# EAGLE schematic GPS_radiologger_v15 (EAGLE 9.6.2)
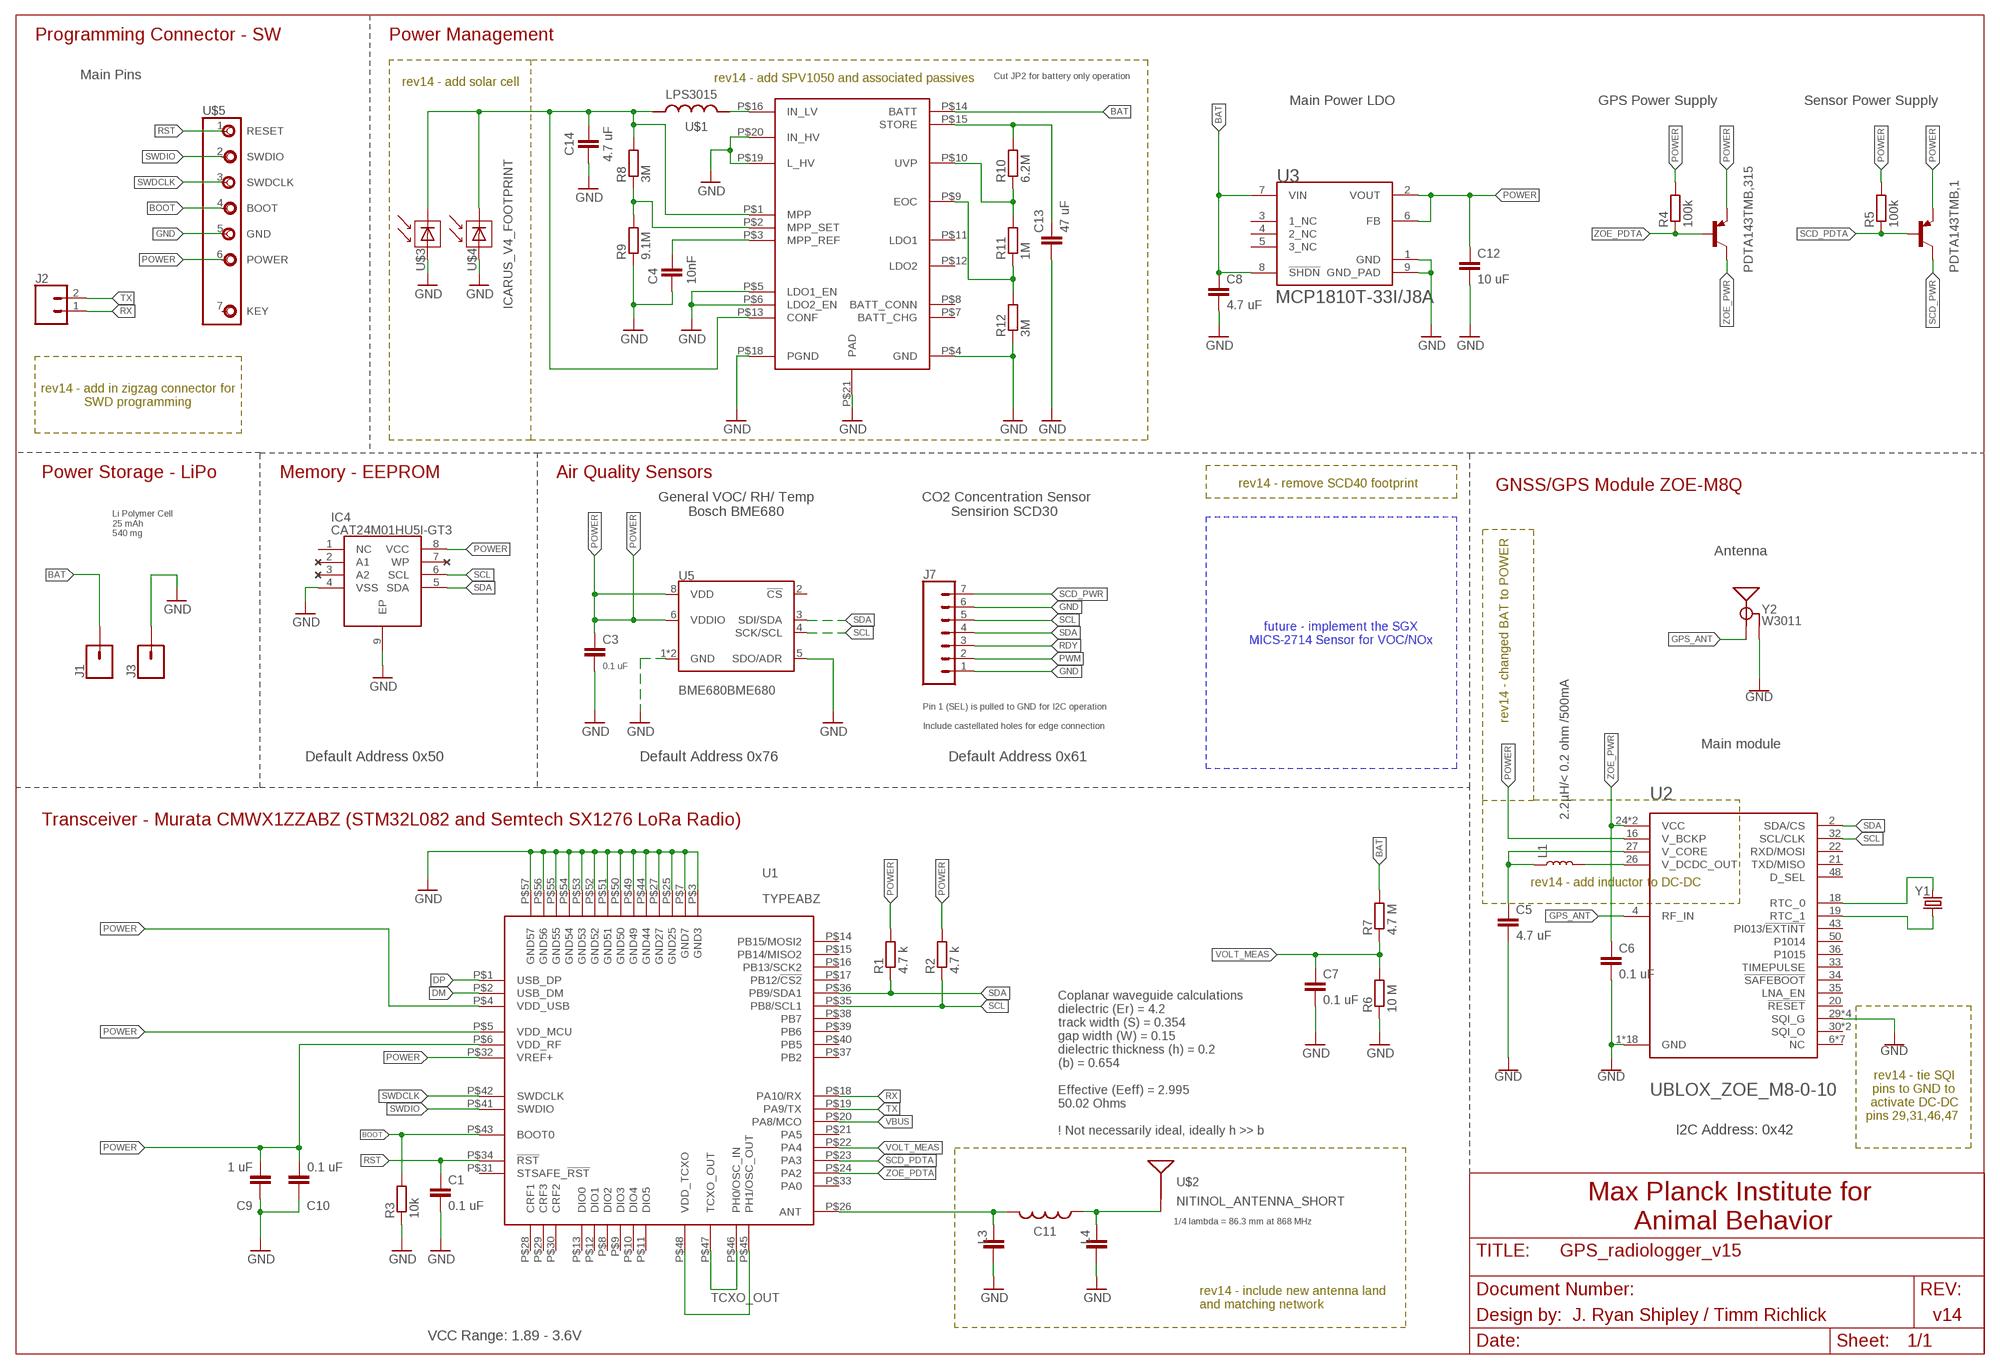
[diagram p0: schematic, sheet 1]

## Parts
C1  0.1 uF  C-EUC0201  [C0201]
C3  0.1 uF  C-EUC0201  [C0201]
C4  10nF  C-EUC0201  [C0201]
C5  4.7 uF  C-EUC0201  [C0201]
C6  0.1 uF  C-EUC0201  [C0201]
C7  0.1 uF  C-EUC0201  [C0201]
C8  4.7 uF  C-EUC0201  [C0201]
C9  1 uF  C-EUC0201  [C0201]
C10  0.1 uF  C-EUC0201  [C0201]
C11  0.1uF  L-USL0201  [L0201]
C12  10 uF  C-EUC0201  [C0201]
C13  47 uF  C-EUC0805K  [C0805K]
C14  4.7 uF  C-EUC0201  [C0201]
IC4  CAT24M01HU5I-GT3  [SON50P300X200X55-9N]
J1  CONN_01PTH_NO_SILK_YES_STOP  [1X01_NO_SILK]
J2  CONN_021X02_NO_SILK  [1X02_NO_SILK]
J3  CONN_01PTH_NO_SILK_YES_STOP  [1X01_NO_SILK]
J7  CONN_07NO_SILK  [1X07_NO_SILK]
L1  2.2µH/< 0.2 ohm /500mA  INDUCTOR-0805-3.3UH  [0805]
L3  C-EUC0201  [C0201]
L4  C-EUC0201  [C0201]
PDTA143TMB,1  TINYPICO-PNPAMB  [SOT883(B)]
PDTA143TMB,315  TINYPICO-PNPAMB  [SOT883(B)]
R1  4.7 k  R-EU_R0201  [R0201]
R2  4.7 k  R-EU_R0201  [R0201]
R3  10k  R-EU_R0201  [R0201]
R4  100k  R-EU_R0201  [R0201]
R5  100k  R-EU_R0201  [R0201]
R6  10 M  R-EU_R0201  [R0201]
R7  4.7 M  R-EU_R0201  [R0201]
R8  3M  R-EU_R0201  [R0201]
R9  9.1M  R-EU_R0201  [R0201]
R10  6.2M  R-EU_R0201  [R0201]
R11  1M  R-EU_R0201  [R0201]
R12  3M  R-EU_R0201  [R0201]
U1  TYPEABZ  [TYPEABZ]
U2  UBLOX_ZOE_M8-0-10  [UBLOX_ZOE_M8-0-10]
U3  MICROCHIP_MCP1810T-33I-J8AMICROCHIP_MCP1810T-33I-J8A_0_0  [MICROCHIP_MCP1810T-33I-J8A_0]
U4  SPV1050  [SPV1050]
U5  BME680BME680  [LGA3.0X3.0]
U$1  LPS3015  [LPS_3015]
U$2  NITINOL_ANTENNA_SHORT  [ICARUS_NITINOL_ANTENNA_SHORT]
U$3  ICARUS_V4_FOOTPRINT  [ICARUS_FULL_FOOTPRINT]
U$4  ICARUS_V4_FOOTPRINT  [ICARUS_FULL_FOOTPRINT]
U$5  ALBERT_ZIGZAG-ISP  [ALBERT_ZIGZAG-ISP]
Y1  32.768kHz  CRYSTAL-32.768KHZ  [CRYSTAL-SMD-1.0X1.2MM]
Y2  W3011  GPS_CHIP_ANTENNAW3011  [W3011]

## Nets
BAT: C8.1 J1.1 R7.2 U3.7(VIN) U3.8(!SHDN!) U4.P$14(BATT)
BOOT: R3.2 U1.P$43(BOOT0) U$5.4(BOOT)
DM: U1.P$2(USB_DM)
DP: U1.P$1(USB_DP)
GND: C1.2 C3.2 C4.2 C5.2 C6.2 C7.2 C8.2 C9.1 C10.1 C12.2 C13.2 C14.2 IC4.4(VSS) IC4.9(EP) J3.1 J7.1 J7.6 L3.2 L4.2 R3.1 R6.1 R9.1 R12.1 U1.P$3(GND3) U1.P$7(GND7) U1.P$25(GND25) U1.P$27(GND27) U1.P$44(GND44) U1.P$49(GND49) U1.P$50(GND50) U1.P$51(GND51) U1.P$52(GND52) U1.P$53(GND53) U1.P$54(GND54) U1.P$55(GND55) U1.P$56(GND56) U1.P$57(GND57) U2.1(GND) U2.3(GND) U2.5(GND) U2.7(GND) U2.8(GND) U2.9(GND) U2.10(GND) U2.11(GND) U2.12(GND) U2.17(GND) U2.23(GND) U2.29(SQI_G) U2.31(SQI_G) U2.37(GND) U2.38(GND) U2.39(GND) U2.40(GND) U2.41(GND) U2.44(GND) U2.46(SQI_G) U2.47(SQI_G) U2.49(GND) U3.1(GND) U3.9(GND_PAD) U4.P$4(GND) U4.P$5(LDO1_EN) U4.P$6(LDO2_EN) U4.P$18(PGND) U4.P$19(L_HV) U4.P$20(IN_HV) U4.P$21(PAD) U5.1(GND) U5.5(SDO/ADR) U5.7(GND) U$3.P$3(MINUS) U$4.P$3(MINUS) U$5.5(GND) Y2.2(GND) Y2.3(GND)
GPS_ANT [antenna]: U2.4(RF_IN) Y2.1(SIGNAL)
N$1: U1.P$45(PH1/OSC_OUT) U1.P$48(VDD_TCXO)
N$2 [antenna]: C11.2 L3.1 U1.P$26(ANT)
N$3: C5.1 L1.1 U2.27(V_CORE)
N$4: U4.P$16(IN_LV) U$1.P$2
N$5: L1.2 U2.26(V_DCDC_OUT)
N$6: R8.1 R9.2 U4.P$2(MPP_SET)
N$7: C14.1 R8.2 U4.P$1(MPP) U4.P$13(CONF) U$1.P$1 U$3.P$1(PLUS) U$4.P$1(PLUS)
N$8: R10.1 R11.2 U4.P$10(UVP)
N$9: R11.1 R12.2 U4.P$9(EOC)
N$11 [antenna]: C11.1 L4.1 U$2.1(SIGNAL) U$2.2(SIGNAL) U$2.3(SIGNAL)
N$12: C13.1 R10.2 U4.P$15(STORE)
N$13: C4.1 U4.P$3(MPP_REF)
N$14: U2.18(RTC_0) Y1.P$2
N$15: U2.19(RTC_1) Y1.P$1
POWER: C3.1 C9.2 C10.2 C12.1 IC4.8(VCC) PDTA143TMB,1.2(E) PDTA143TMB,315.2(E) R1.2 R2.2 R4.2 R5.2 U1.P$4(VDD_USB) U1.P$5(VDD_MCU) U1.P$6(VDD_RF) U1.P$32(VREF+) U2.16(V_BCKP) U3.2(VOUT) U3.6(FB) U5.6(VDDIO) U5.8(VDD) U$5.6(POWER)
PWM: J7.2
RDY: J7.3
RST: C1.1 U1.P$34(!RST) U$5.1(RESET)
RX: J2.1 U1.P$18(PA10/RX)
SCD_PDTA: PDTA143TMB,1.1(B) R5.1 U1.P$23(PA3)
SCD_PWR: J7.7 PDTA143TMB,1.3(C)
SCL: IC4.6(SCL) J7.5 R2.1 U1.P$35(PB8/SCL1) U2.32(SCL/CLK) U5.4(SCK/SCL)
SDA: IC4.5(SDA) J7.4 R1.1 U1.P$36(PB9/SDA1) U2.2(SDA/CS) U5.3(SDI/SDA)
SWDCLK: U1.P$42(SWDCLK) U$5.3(SWDCLK)
SWDIO: U1.P$41(SWDIO) U$5.2(SWDIO)
TCXO_OUT: U1.P$46(PH0/OSC_IN) U1.P$47(TCXO_OUT)
TX: J2.2 U1.P$19(PA9/TX)
VBUS: U1.P$20(PA8/MCO)
VOLT_MEAS: C7.1 R6.2 R7.1 U1.P$22(PA4)
ZOE_PDTA: PDTA143TMB,315.1(B) R4.1 U1.P$24(PA2)
ZOE_PWR: C6.1 PDTA143TMB,315.3(C) U2.24(VCC) U2.25(VCC)
Unconnected: IC4.1(NC) IC4.2(A1) IC4.3(A2) IC4.7(WP) U1.P$8(DIO2) U1.P$9(DIO3) U1.P$10(DIO4) U1.P$11(DIO5) U1.P$12(DIO1) U1.P$13(DIO0) U1.P$14(PB15/MOSI2) U1.P$15(PB14/MISO2) U1.P$16(PB13/SCK2) U1.P$17(PB12/!CS2) U1.P$21(PA5) U1.P$28(CRF1) U1.P$29(CRF3) U1.P$30(CRF2) U1.P$31(STSAFE_!RST) U1.P$33(PA0) U1.P$37(PB2) U1.P$38(PB7) U1.P$39(PB6) U1.P$40(PB5) U2.6(NC) U2.13(NC) U2.14(NC) U2.15(NC) U2.20(!RESET) U2.21(TXD/MISO) U2.22(RXD/MOSI) U2.28(NC) U2.30(SQI_O) U2.33(TIMEPULSE) U2.34(!SAFEBOOT) U2.35(LNA_EN) U2.36(P1015) U2.42(NC) U2.43(PI013/!EXTINT) U2.45(SQI_O) U2.48(D_SEL) U2.50(P1014) U2.51(NC) U3.3(1_NC) U3.4(2_NC) U3.5(3_NC) U4.P$7(BATT_CHG) U4.P$8(BATT_CONN) U4.P$11(LDO1) U4.P$12(LDO2) U5.2(!CS) U$5.7(KEY)

## Notes on the sheet
- Programming Connector - SW | Power Management
- rev14 - add SPV1050 and associated passives
- Main Pins | Cut JP2 for battery only operation
- rev14 - add solar cell
- Main Power LDO | GPS Power Supply | Sensor Power Supply
- rev14 - add in zigzag connector for
  SWD programming
- Power Storage - LiPo | Memory - EEPROM | Air Quality Sensors | rev14 - remove SCD40 footprint
- GNSS/GPS Module ZOE-M8Q
- General VOC/ RH/ Temp
  Bosch BME680
- CO2 Concentration Sensor
  Sensirion SCD30
- Li Polymer Cell
  25 mAh
  540 mg
- Antenna
- future - implement the SGX
  MICS-2714 Sensor for VOC/NOx
- Pin 1 (SEL) is pulled to GND for I2C operation
- rev14 - changed BAT to POWER
- Include castellated holes for edge connection
- Main module
- Default Address 0x50 | Default Address 0x76 | Default Address 0x61
- Transceiver - Murata CMWX1ZZABZ (STM32L082 and Semtech SX1276 LoRa Radio)
- rev14 - add inductor to DC-DC
- rev14 - tie SQI 
  pins to GND to 
  activate DC-DC
  pins 29,31,46,47
- Coplanar waveguide calculations
  dielectric (Er) = 4.2
  track width (S) = 0.354
  gap width (W) = 0.15
  dielectric thickness (h) = 0.2
  (b) = 0.654
  
  Effective (Eeff) = 2.995
  50.02 Ohms
  
  ! Not necessarily ideal, ideally h >> b
- I2C Address: 0x42
- Max Planck Institute for 
  Animal Behavior
- 1/4 lambda = 86.3 mm at 868 MHz
- rev14 - include new antenna land
  and matching network
- Design by: | J. Ryan Shipley / Timm Richlick | v14
- VCC Range: 1.89 - 3.6V

## Library data of the parts
C1 C3-C10 C12-C14 L3 L4 = rcl:C-EU: CAPACITOR, European symbol; SPICEPREFIX: C
C11 = rcl:L-US: INDUCTOR, American symbol; SPICEPREFIX: L
IC4 = CAT24M01HU5I-GT3-CorrectedV2:CAT24M01HU5I-GT3: EEPROM 1MB I2C SERIAL EEPROM Source: Datasheet <http://www.onsemi.com/pub/Collateral/CAT24M01-D.PDF>; ALLIED_NUMBER: 70300250; ALLIED_PRICE-STOCK: http://www.alliedelec.com/on-semiconductor-cat24m01hu5i-gt3/70300250/; DESCRIPTION: EEPROM 1MB I2C SERIAL EEPROM; HEIGHT: 0.55mm; MANUFACTURER_NAME: ON Semiconductor; MANUFACTURER_PART_NUMBER: CAT24M01HU5I-GT3; MOUSER_PART_NUMBER: 863-CAT24M01HU5I-GT3; MOUSER_PRICE-STOCK: https://www.mouser.com/Search/Refine.aspx?Keyword=863-CAT24M01HU5I-GT3; RS_PART_NUMBER: 7814831P; RS_PRICE-STOCK: http://uk.rs-online.com/web/p/products/7814831P
J1 J3 = SparkFun-Connectors:CONN_01: Single connection point. Often used as Generic Header-pin footprint for 0.1 inch spaced/style header connections On any of the 0.1 inch spaced packages, you can populate with these: Break Away Headers - Straight <https://www.sparkfun.com/products/116> (PRT-00116) Break Away Male Headers - Right Angle <https://www.sparkfun.com/products/553> (PRT-00553) Female Headers <https://www.sparkfun.com/products/115> (PRT-00115) Break Away Headers - Machine Pin <https://www.sparkfun.com/products/117> (PRT-00117) Break Away Female Headers - Swiss Machine Pin <https://www.sparkfun.com/products/743> (PRT-00743) This device is also useful as a general connection point to wire up your design to another part of your project. Our various solder wires solder well into these plated through hole pads. Hook-Up Wire - Assortment (Stranded, 22 AWG) <https://www.sparkfun.com/products/11375> (PRT-11375) Hook-Up Wire - Assortment (Solid Core, 22 AWG) <https://www.sparkfun.com/products/11367> (PRT-11367) View the entire wire category on our website here <https://www.sparkfun.com/categories/141> Special notes: SMTSO-256-ET is a "flush mount" nut for a 4-40 screw. We mostly use this on specialty testbeds; it is a nice way to connect hardware to your PCB at an adjustable hieght. Also note, the SNAP packages are for using a snappable style connector. We sell a baggie of snaps and they are also used on two LilyPad designs: Snap Assortment - 30 pack (male and female) <https://www.sparkfun.com/products/11347> (DEV-11347) LilyPad Arduino SimpleSnap <https://www.sparkfun.com/products/10941> (DEV-10941) LilyPad SimpleSnap Protoboard <https://www.sparkfun.com/products/10940> (DEV-10940)
J2 = SparkFun-Connectors:CONN_02: Multi connection point. Often used as Generic Header-pin footprint for 0.1 inch spaced/style header connections On any of the 0.1 inch spaced packages, you can populate with these: Break Away Headers - Straight <https://www.sparkfun.com/products/116> (PRT-00116) Break Away Male Headers - Right Angle <https://www.sparkfun.com/products/553> (PRT-00553) Female Headers <https://www.sparkfun.com/products/115> (PRT-00115) Break Away Headers - Machine Pin <https://www.sparkfun.com/products/117> (PRT-00117) Break Away Female Headers - Swiss Machine Pin <https://www.sparkfun.com/products/743> (PRT-00743) For SCREWTERMINALS and SPRING TERMINALS visit here: Screw Terimnals on SparkFun.com <https://www.sparkfun.com/search/results?term=Screw+Terminals> (5mm/3.5mm/2.54mm spacing) This device is also useful as a general connection point to wire up your design to another part of your project. Our various solder wires solder well into these plated through hole pads. Hook-Up Wire - Assortment (Stranded, 22 AWG) <https://www.sparkfun.com/products/11375> (PRT-11375) Hook-Up Wire - Assortment (Solid Core, 22 AWG) <https://www.sparkfun.com/products/11367> (PRT-11367) View the entire wire category on our website here <https://www.sparkfun.com/categories/141> Special notes: Molex polarized connector foot print use with: PRT-08233 with associated crimp pins and housings. 2.54_SCREWTERM for use with PRT-10571. 3.5mm Screw Terminal footprints for PRT-08084 5mm Screw Terminal footprints for use with PRT-08432
J7 = SparkFun-Connectors:CONN_07: Multi connection point. Often used as Generic Header-pin footprint for 0.1 inch spaced/style header connections On any of the 0.1 inch spaced packages, you can populate with these: Break Away Headers - Straight <https://www.sparkfun.com/products/116> (PRT-00116) Break Away Male Headers - Right Angle <https://www.sparkfun.com/products/553> (PRT-00553) Female Headers <https://www.sparkfun.com/products/115> (PRT-00115) Break Away Headers - Machine Pin <https://www.sparkfun.com/products/117> (PRT-00117) Break Away Female Headers - Swiss Machine Pin <https://www.sparkfun.com/products/743> (PRT-00743) For SCREWTERMINALS and SPRING TERMINALS visit here: Screw Terimnals on SparkFun.com <https://www.sparkfun.com/search/results?term=Screw+Terminals> (5mm/3.5mm/2.54mm spacing) This device is also useful as a general connection point to wire up your design to another part of your project. Our various solder wires solder well into these plated through hole pads. Hook-Up Wire - Assortment (Stranded, 22 AWG) <https://www.sparkfun.com/products/11375> (PRT-11375) Hook-Up Wire - Assortment (Solid Core, 22 AWG) <https://www.sparkfun.com/products/11367> (PRT-11367) View the entire wire category on our website here <https://www.sparkfun.com/categories/141> Special notes: Molex polarized connector foot print use with SKU : PRT-08231 with associated crimp pins and housings. 1MM SMD Version SKU: PRT-10208 NOTES ON THE VARIANTS LOCK and LOCK_LONGPADS... This footprint was designed to help hold the alignment of a through-hole component (i.e. 6-pin header) while soldering it into place. You may notice that each hole has been shifted either up or down by 0.005 of an inch from it's more standard position (which is a perfectly straight line). This slight alteration caused the pins (the squares in the middle) to touch the edges of the holes. Because they are alternating, it causes a "brace" to hold the component in place. 0.005 has proven to be the perfect amount of "off-center" position when using our standard breakaway headers. Although looks a little odd when you look at the bare footprint, once you have a header in there, the alteration is very hard to notice. Also,if you push a header all the way into place, it is covered up entirely on the bottom side.
L1 = SparkFun-Coils:INDUCTOR: Inductors Resist changes in electrical current. Basically a coil of wire. SparkFun Products: SparkFun Load Cell Amplifier - HX711 <https://www.sparkfun.com/products/13879> IOIO-OTG - V2.2 <https://www.sparkfun.com/products/13613>; PROD_ID: NDUC-13076; VALUE: 3.3µH/±20%/450mA
PDTA143TMB,1 PDTA143TMB,315 = UnexpectedMaker:TINYPICO-PNP: PNP general purpose transistors AAL Eindhoven MK
R1-R12 = rcl:R-EU_: RESISTOR, European symbol; SPICEPREFIX: R
U1 = Kris:TYPEABZ: CMWX1ZZABZ-078
U2 = SparkFun-GPS:UBLOX_ZOE_M8-0-10: UBLOX ZOE-M8Q-0-10 u-blox ZOE-M8 standard precision GNSS SiP (System in Package) modules feature the high performance u-blox M8 GNSS engine. ZOE-M8’s ultra-miniature form factor integrates a complete GNSS receiver including SAW filter, LNA and TCXO. Handles all GNSS systems and can simulatenously use up to three of them, with accuracy ranging from 2.5m to 4m. GPS GLONASS BeiDou Galileo This can be corrected with the SBAS or QZSS augmentation systems.; PROD_ID: IC-14251
U3 = MCP1810:MICROCHIP_MCP1810T-33I-J8A: Ultra-Low Quiescent Current LDO Regulator; CENTROID_NOT_SPECIFIED: No; DATASHEET: http://ww1.microchip.com/downloads/en/DeviceDoc/20005623A.pdf; DIGIKEY_DESCRIPTION: IC REG LINEAR 150MA 8-VDFN; DIGIKEY_PART_NUMBER: MCP1810T-33I/J8ACT-ND; IPC_LAND_PATTERN_NAME: DFN200X200X85-8; LEAD_FREE: yes; MF: Microchip; MFG_PACKAGE_IDENT: C04-3207A; MOUSER_PART_NUMBER: 579-MCP1810T-33I/J8A; MPN: MCP1810T-33I/J8A; PACKAGE: VDFN8; PREFIX: U; ROHS: yes; TEMPERATURE_RANGE_HIGH: +85°C; TEMPERATURE_RANGE_LOW: -40°C
U4 = STM-SPV1050_V2:SPV1050
U5 = SparkFun-Sensors:BME680: Bosch BME680 – Combined Humidity and Pressure Sensor The BME680 is as combined digital humidity, pressure and temperature sensor based on proven sensing principles. The sensor module is housed in an extremely compact metal-lid LGA package with a footprint of only 3.0×3.0mm with a height of 0.93mm. Its small dimensions and its low power consumption allow the implementation in battery driven devices such as handsets, GPS modules or watches.; PROD_ID: IC-14656
U$1 = coilcraft_custom:LPS3015
U$2 = Antenna_mounts:NITINOL_ANTENNA_SHORT
U$3 U$4 = TrisolX_Solar_Cells:ICARUS_V4_FOOTPRINT
U$5 = Zigzag ISP connector:ALBERT_ZIGZAG-ISP
Y1 = SparkFun-Clocks:CRYSTAL-32.768KHZ: 32.768kHz Crystal Frequency: 32.768kHz Frequency Stability: ±20ppm Load Capacitance: 12.5pF (PTH-2X6 & SMD-3.2X1.5), 6pF (SMD-2X6) SparkFun Products: SparkFun BigTime Watch Kit <https://www.sparkfun.com/products/11734> SparkFun nRF52832 Breakout <https://www.sparkfun.com/products/13990> SparkFun Real Time Clock Module <https://www.sparkfun.com/products/12708>; XTAL: SC12S-7PF20PPM
Y2 = SparkFun-GPS:GPS_CHIP_ANTENNA; PROD_ID: ANT-14304

## Net classes
2 antenna: width 0.356 mm, clearance 0.178 mm